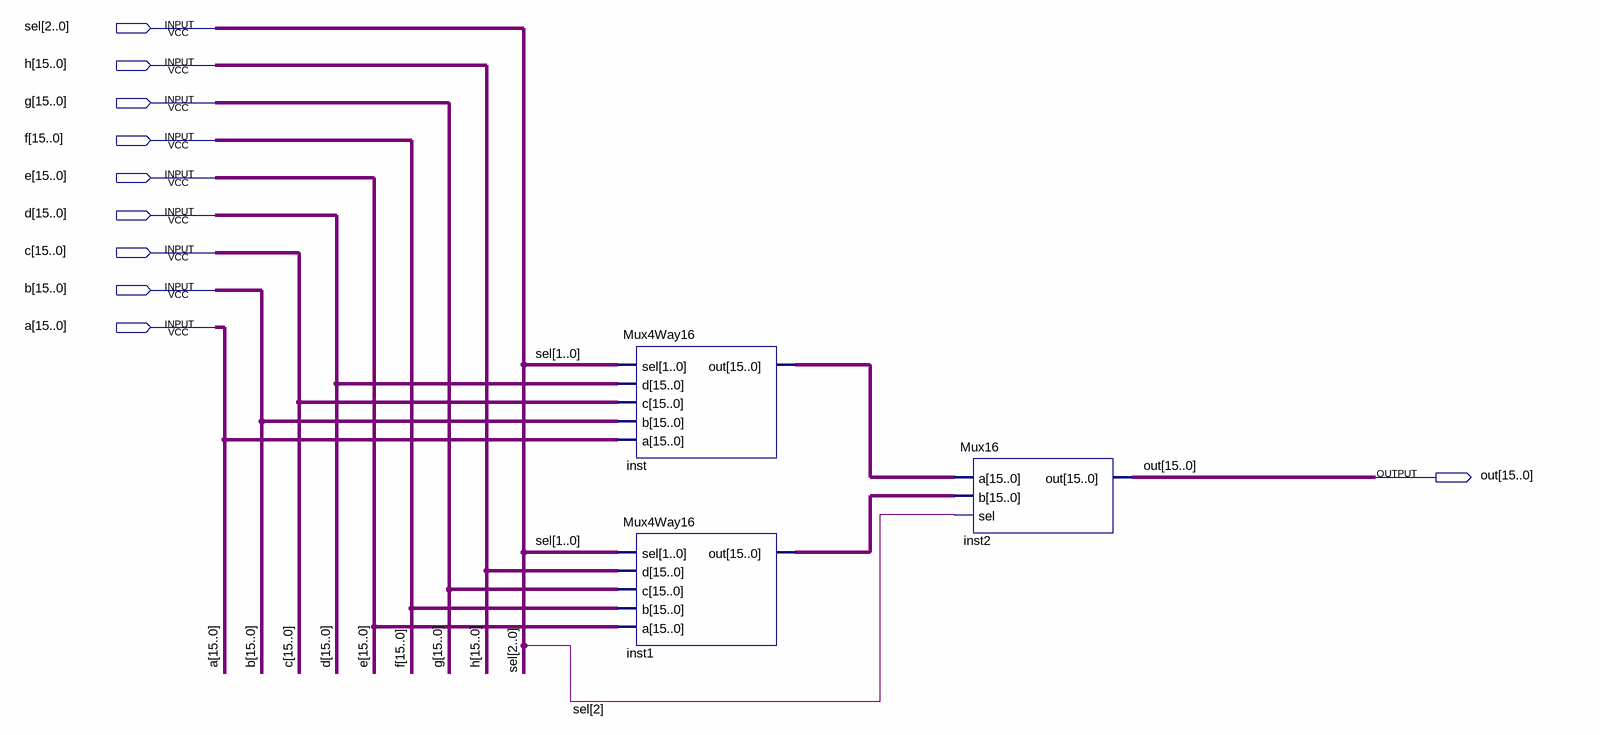
[diagram p0: schematic sheet]
// Quartus schematic Mux8Way16.bdf as structural Verilog: 3 symbols, 10 pins
module Mux8Way16 (
  input  [2:0] sel,
  input  [15:0] h,
  input  [15:0] g,
  input  [15:0] f,
  input  [15:0] e,
  input  [15:0] d,
  input  [15:0] c,
  input  [15:0] b,
  input  [15:0] a,
  output [15:0] out
);

  wire [15:0] inst1_out, inst_out;

  Mux4Way16 inst (.sel(sel[1:0]), .d(d), .c(c), .b(b), .a(a), .out(inst_out));
  Mux4Way16 inst1 (.sel(sel[1:0]), .d(h), .c(g), .b(f), .a(e), .out(inst1_out));
  Mux16 inst2 (.a(inst_out), .b(inst1_out), .sel(sel[2]), .out(out));
endmodule
